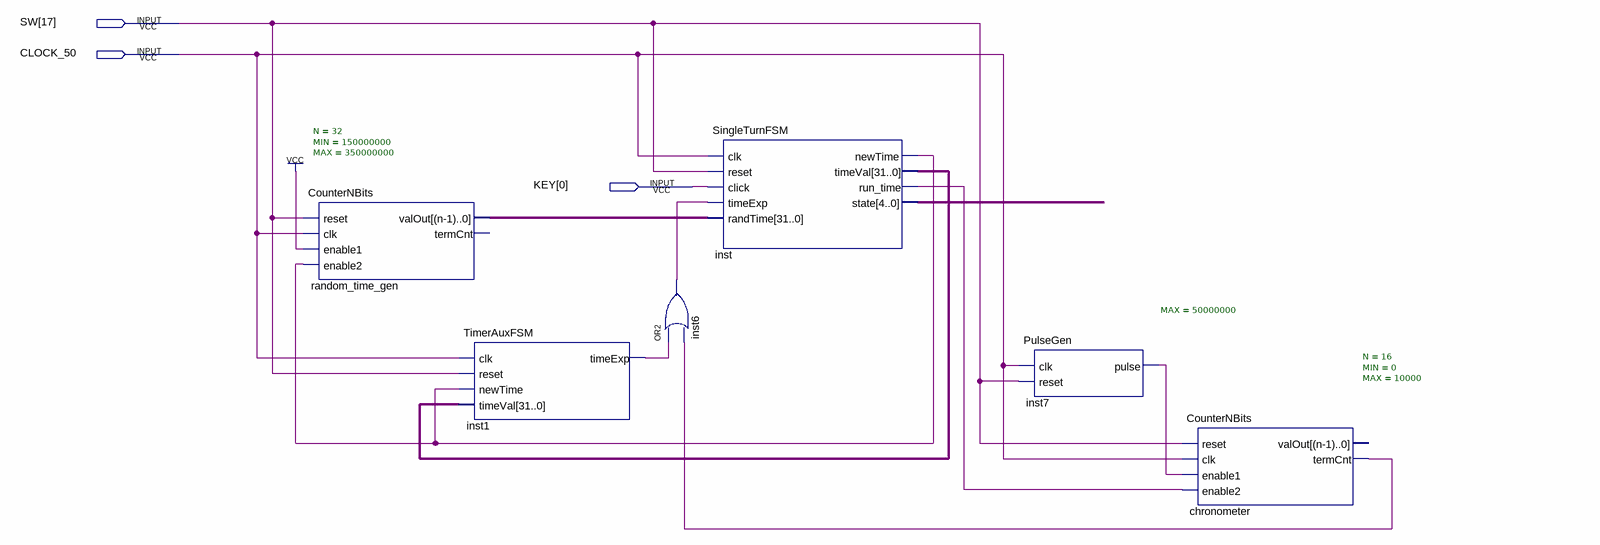
[diagram p0: schematic sheet]
// Quartus schematic toplevel_schematic.bdf as structural Verilog: 6 symbols, 3 pins
module toplevel_schematic (
  input  [17:17] SW,
  input  CLOCK_50,
  input  [0:0] KEY
);

  wire chronometer_termcnt, inst1_timeexp, inst6_out, inst7_pulse, inst_newtime, inst_run_time;
  wire [4:0] inst_state;
  wire [31:0] inst_timeval, random_time_gen_valout;

  CounterNBits #(.N(32), .MIN(150000000), .MAX(350000000)) random_time_gen (
    .reset(SW[17]), .clk(CLOCK_50), .enable1(1'b1), .enable2(inst_newtime), .valOut(random_time_gen_valout));  // open: termCnt
  TimerAuxFSM inst1 (
    .clk(CLOCK_50), .reset(SW[17]), .newTime(inst_newtime), .timeVal(inst_timeval), .timeExp(inst1_timeexp));
  or inst6 (inst6_out, inst1_timeexp, chronometer_termcnt);
  SingleTurnFSM inst (
    .clk(CLOCK_50), .reset(SW[17]), .click(KEY[0]), .timeExp(inst6_out), .randTime(random_time_gen_valout),
    .newTime(inst_newtime), .timeVal(inst_timeval), .run_time(inst_run_time), .state(inst_state));
  PulseGen #(.MAX(50000000)) inst7 (.clk(CLOCK_50), .reset(SW[17]), .pulse(inst7_pulse));
  CounterNBits #(.N(16), .MIN(0), .MAX(10000)) chronometer (
    .reset(SW[17]), .clk(CLOCK_50), .enable1(inst7_pulse), .enable2(inst_run_time),
    .termCnt(chronometer_termcnt));  // open: valOut
endmodule
